# EAGLE design Logic Engine - Rear LED (EAGLE 6.5.0)
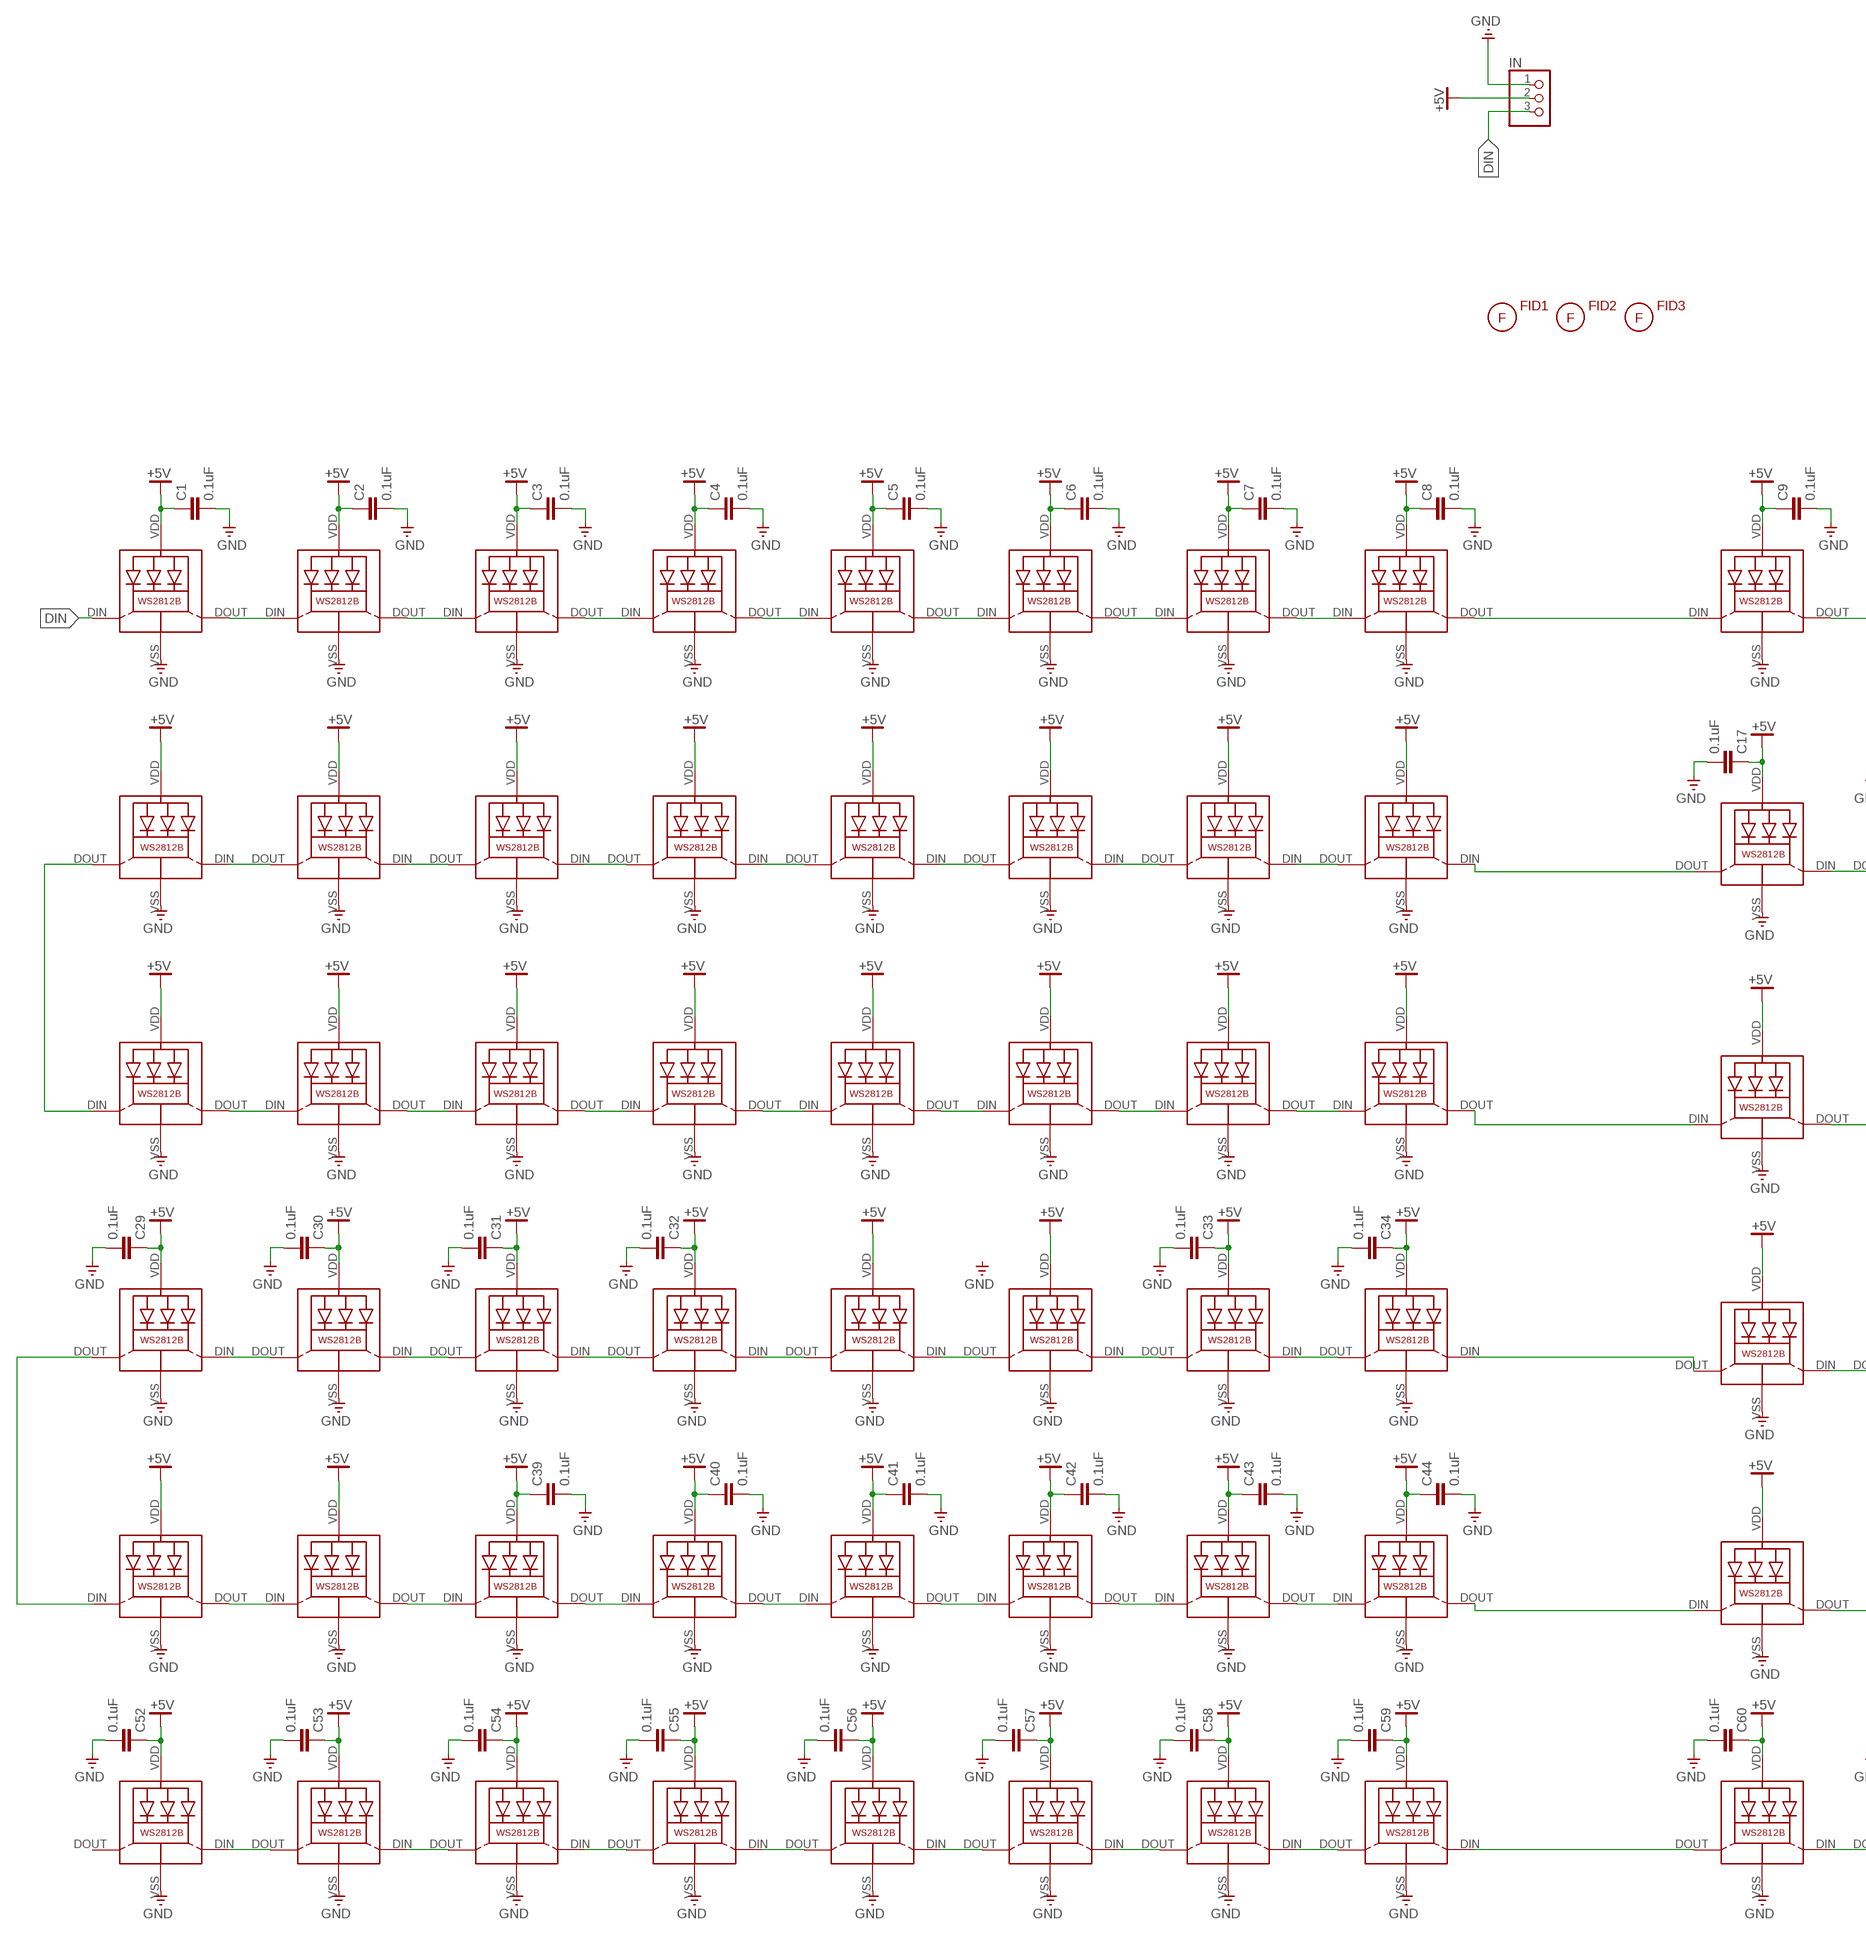
[diagram p0: schematic, sheet 1, part 1 of 2]
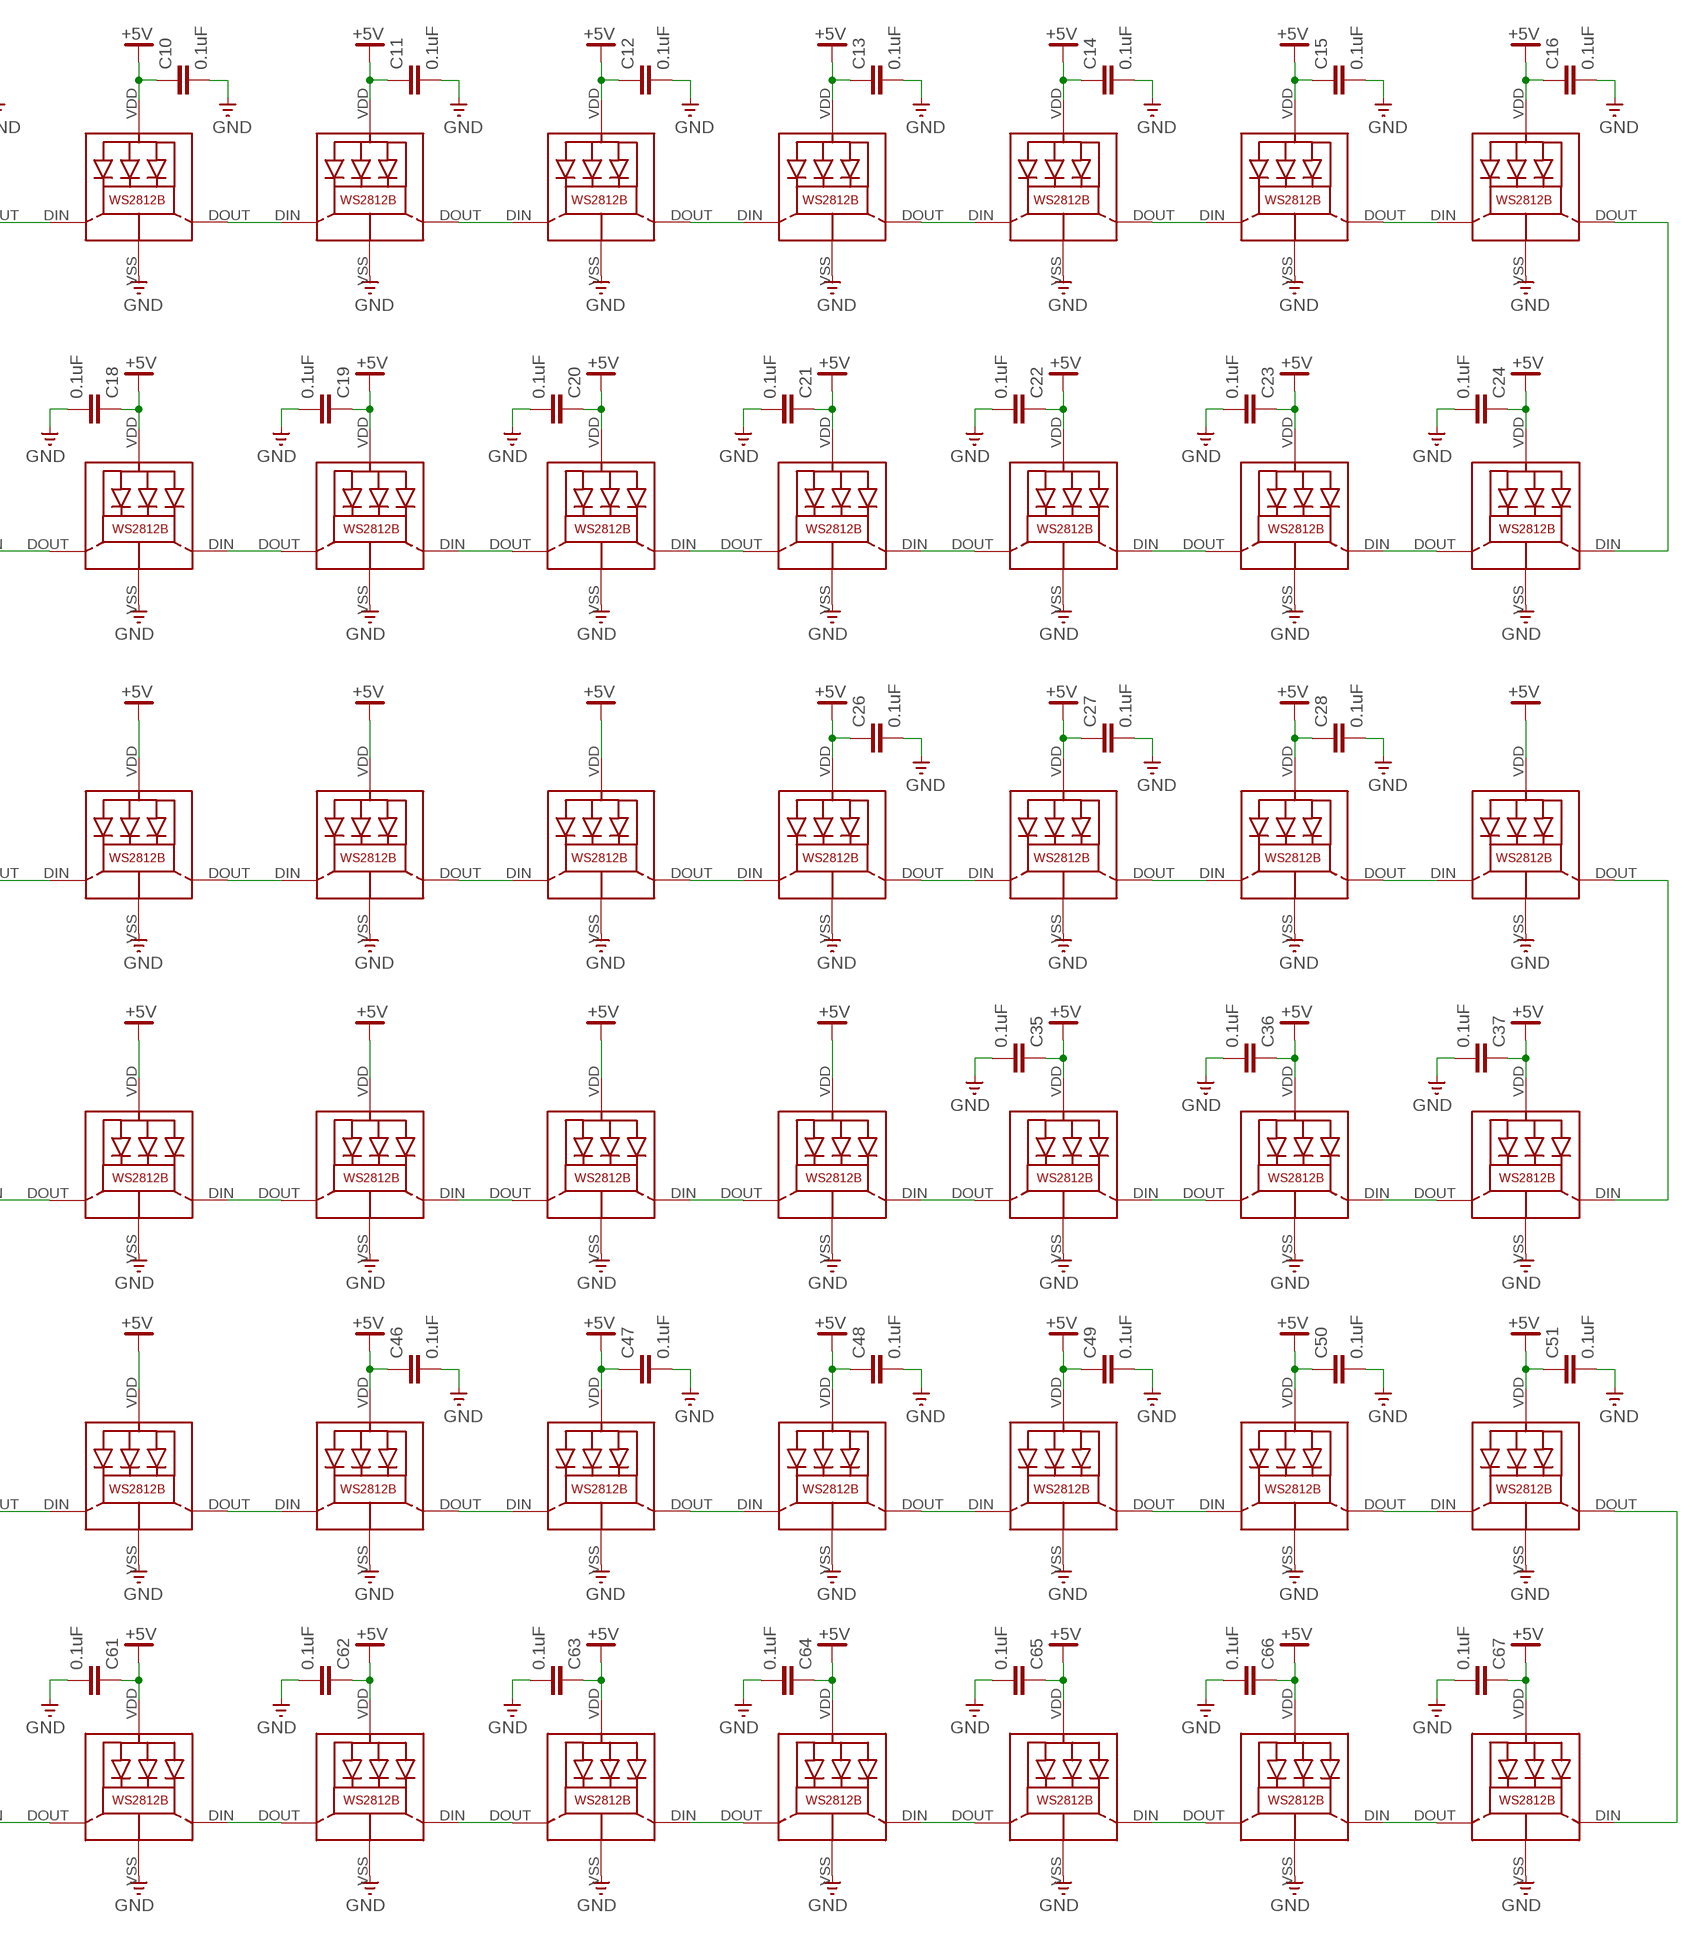
[diagram p1: schematic, sheet 1, part 2 of 2]

## Parts
C1  0.1uF  CAP0603-CAP  [0603-CAP]
C2  0.1uF  CAP0603-CAP  [0603-CAP]
C3  0.1uF  CAP0603-CAP  [0603-CAP]
C4  0.1uF  CAP0603-CAP  [0603-CAP]
C5  0.1uF  CAP0603-CAP  [0603-CAP]
C6  0.1uF  CAP0603-CAP  [0603-CAP]
C7  0.1uF  CAP0603-CAP  [0603-CAP]
C8  0.1uF  CAP0603-CAP  [0603-CAP]
C9  0.1uF  CAP0603-CAP  [0603-CAP]
C10  0.1uF  CAP0603-CAP  [0603-CAP]
C11  0.1uF  CAP0603-CAP  [0603-CAP]
C12  0.1uF  CAP0603-CAP  [0603-CAP]
C13  0.1uF  CAP0603-CAP  [0603-CAP]
C14  0.1uF  CAP0603-CAP  [0603-CAP]
C15  0.1uF  CAP0603-CAP  [0603-CAP]
C16  0.1uF  CAP0603-CAP  [0603-CAP]
C17  0.1uF  CAP0603-CAP  [0603-CAP]
C18  0.1uF  CAP0603-CAP  [0603-CAP]
C19  0.1uF  CAP0603-CAP  [0603-CAP]
C20  0.1uF  CAP0603-CAP  [0603-CAP]
C21  0.1uF  CAP0603-CAP  [0603-CAP]
C22  0.1uF  CAP0603-CAP  [0603-CAP]
C23  0.1uF  CAP0603-CAP  [0603-CAP]
C24  0.1uF  CAP0603-CAP  [0603-CAP]
C26  0.1uF  CAP0603-CAP  [0603-CAP]
C27  0.1uF  CAP0603-CAP  [0603-CAP]
C28  0.1uF  CAP0603-CAP  [0603-CAP]
C29  0.1uF  CAP0603-CAP  [0603-CAP]
C30  0.1uF  CAP0603-CAP  [0603-CAP]
C31  0.1uF  CAP0603-CAP  [0603-CAP]
C32  0.1uF  CAP0603-CAP  [0603-CAP]
C33  0.1uF  CAP0603-CAP  [0603-CAP]
C34  0.1uF  CAP0603-CAP  [0603-CAP]
C35  0.1uF  CAP0603-CAP  [0603-CAP]
C36  0.1uF  CAP0603-CAP  [0603-CAP]
C37  0.1uF  CAP0603-CAP  [0603-CAP]
C39  0.1uF  CAP0603-CAP  [0603-CAP]
C40  0.1uF  CAP0603-CAP  [0603-CAP]
C41  0.1uF  CAP0603-CAP  [0603-CAP]
C42  0.1uF  CAP0603-CAP  [0603-CAP]
C43  0.1uF  CAP0603-CAP  [0603-CAP]
C44  0.1uF  CAP0603-CAP  [0603-CAP]
C46  0.1uF  CAP0603-CAP  [0603-CAP]
C47  0.1uF  CAP0603-CAP  [0603-CAP]
C48  0.1uF  CAP0603-CAP  [0603-CAP]
C49  0.1uF  CAP0603-CAP  [0603-CAP]
C50  0.1uF  CAP0603-CAP  [0603-CAP]
C51  0.1uF  CAP0603-CAP  [0603-CAP]
C52  0.1uF  CAP0603-CAP  [0603-CAP]
C53  0.1uF  CAP0603-CAP  [0603-CAP]
C54  0.1uF  CAP0603-CAP  [0603-CAP]
C55  0.1uF  CAP0603-CAP  [0603-CAP]
C56  0.1uF  CAP0603-CAP  [0603-CAP]
C57  0.1uF  CAP0603-CAP  [0603-CAP]
C58  0.1uF  CAP0603-CAP  [0603-CAP]
C59  0.1uF  CAP0603-CAP  [0603-CAP]
C60  0.1uF  CAP0603-CAP  [0603-CAP]
C61  0.1uF  CAP0603-CAP  [0603-CAP]
C62  0.1uF  CAP0603-CAP  [0603-CAP]
C63  0.1uF  CAP0603-CAP  [0603-CAP]
C64  0.1uF  CAP0603-CAP  [0603-CAP]
C65  0.1uF  CAP0603-CAP  [0603-CAP]
C66  0.1uF  CAP0603-CAP  [0603-CAP]
C67  0.1uF  CAP0603-CAP  [0603-CAP]
FID1  FIDUCIAL  [FIDUCIAL_G15]
FID2  FIDUCIAL  [FIDUCIAL_G15]
FID3  FIDUCIAL  [FIDUCIAL_G15]
IN  PINHD-1X3  [1X03]
L1  WS2812B  [WS2812B]
L2  WS2812B  [WS2812B]
L3  WS2812B  [WS2812B]
L4  WS2812B  [WS2812B]
L5  WS2812B  [WS2812B]
L6  WS2812B  [WS2812B]
L7  WS2812B  [WS2812B]
L8  WS2812B  [WS2812B]
L9  WS2812B  [WS2812B]
L10  WS2812B  [WS2812B]
L11  WS2812B  [WS2812B]
L12  WS2812B  [WS2812B]
L13  WS2812B  [WS2812B]
L14  WS2812B  [WS2812B]
L15  WS2812B  [WS2812B]
L16  WS2812B  [WS2812B]
L17  WS2812B  [WS2812B]
L18  WS2812B  [WS2812B]
L19  WS2812B  [WS2812B]
L20  WS2812B  [WS2812B]
L21  WS2812B  [WS2812B]
L22  WS2812B  [WS2812B]
L23  WS2812B  [WS2812B]
L24  WS2812B  [WS2812B]
L25  WS2812B  [WS2812B]
L26  WS2812B  [WS2812B]
L27  WS2812B  [WS2812B]
L28  WS2812B  [WS2812B]
L29  WS2812B  [WS2812B]
L30  WS2812B  [WS2812B]
L31  WS2812B  [WS2812B]
L32  WS2812B  [WS2812B]
L33  WS2812B  [WS2812B]
L34  WS2812B  [WS2812B]
L35  WS2812B  [WS2812B]
L36  WS2812B  [WS2812B]
L37  WS2812B  [WS2812B]
L38  WS2812B  [WS2812B]
L39  WS2812B  [WS2812B]
L40  WS2812B  [WS2812B]
L41  WS2812B  [WS2812B]
L42  WS2812B  [WS2812B]
L43  WS2812B  [WS2812B]
L44  WS2812B  [WS2812B]
L45  WS2812B  [WS2812B]
L46  WS2812B  [WS2812B]
L47  WS2812B  [WS2812B]
L48  WS2812B  [WS2812B]
L49  WS2812B  [WS2812B]
L50  WS2812B  [WS2812B]
L51  WS2812B  [WS2812B]
L52  WS2812B  [WS2812B]
L53  WS2812B  [WS2812B]
L54  WS2812B  [WS2812B]
L55  WS2812B  [WS2812B]
L56  WS2812B  [WS2812B]
L57  WS2812B  [WS2812B]
L58  WS2812B  [WS2812B]
L59  WS2812B  [WS2812B]
L60  WS2812B  [WS2812B]
L61  WS2812B  [WS2812B]
L62  WS2812B  [WS2812B]
L63  WS2812B  [WS2812B]
L64  WS2812B  [WS2812B]
L65  WS2812B  [WS2812B]
L66  WS2812B  [WS2812B]
L67  WS2812B  [WS2812B]
L68  WS2812B  [WS2812B]
L69  WS2812B  [WS2812B]
L70  WS2812B  [WS2812B]
L71  WS2812B  [WS2812B]
L72  WS2812B  [WS2812B]
L73  WS2812B  [WS2812B]
L74  WS2812B  [WS2812B]
L75  WS2812B  [WS2812B]
L76  WS2812B  [WS2812B]
L77  WS2812B  [WS2812B]
L78  WS2812B  [WS2812B]
L79  WS2812B  [WS2812B]
L80  WS2812B  [WS2812B]
L81  WS2812B  [WS2812B]
L82  WS2812B  [WS2812B]
L83  WS2812B  [WS2812B]
L84  WS2812B  [WS2812B]
L85  WS2812B  [WS2812B]
L86  WS2812B  [WS2812B]
L87  WS2812B  [WS2812B]
L88  WS2812B  [WS2812B]
L89  WS2812B  [WS2812B]
L90  WS2812B  [WS2812B]
L91  WS2812B  [WS2812B]
L92  WS2812B  [WS2812B]
L93  WS2812B  [WS2812B]
L94  WS2812B  [WS2812B]
L95  WS2812B  [WS2812B]
L96  WS2812B  [WS2812B]

## Nets
+5V [supply]: C1.1 C2.1 C3.1 C4.1 C5.1 C6.1 C7.1 C8.1 C9.1 C10.1 C11.1 C12.1 C13.1 C14.1 C15.1 C16.1 C17.1 C18.1 C19.1 C20.1 C21.1 C22.1 C23.1 C24.1 C26.1 C27.1 C28.1 C29.1 C30.1 C31.1 C32.1 C33.1 C34.1 C35.1 C36.1 C37.1 C39.1 C40.1 C41.1 C42.1 C43.1 C44.1 C46.1 C47.1 C48.1 C49.1 C50.1 C51.1 C52.1 C53.1 C54.1 C55.1 C56.1 C57.1 C58.1 C59.1 C60.1 C61.1 C62.1 C63.1 C64.1 C65.1 C66.1 C67.1 IN.2 L1.VDD L2.VDD L3.VDD L4.VDD L5.VDD L6.VDD L7.VDD L8.VDD L9.VDD L10.VDD L11.VDD L12.VDD L13.VDD L14.VDD L15.VDD L16.VDD L17.VDD L18.VDD L19.VDD L20.VDD L21.VDD L22.VDD L23.VDD L24.VDD L25.VDD L26.VDD L27.VDD L28.VDD L29.VDD L30.VDD L31.VDD L32.VDD L33.VDD L34.VDD L35.VDD L36.VDD L37.VDD L38.VDD L39.VDD L40.VDD L41.VDD L42.VDD L43.VDD L44.VDD L45.VDD L46.VDD L47.VDD L48.VDD L49.VDD L50.VDD L51.VDD L52.VDD L53.VDD L54.VDD L55.VDD L56.VDD L57.VDD L58.VDD L59.VDD L60.VDD L61.VDD L62.VDD L63.VDD L64.VDD L65.VDD L66.VDD L67.VDD L68.VDD L69.VDD L70.VDD L71.VDD L72.VDD L73.VDD L74.VDD L75.VDD L76.VDD L77.VDD L78.VDD L79.VDD L80.VDD L81.VDD L82.VDD L83.VDD L84.VDD L85.VDD L86.VDD L87.VDD L88.VDD L89.VDD L90.VDD L91.VDD L92.VDD L93.VDD L94.VDD L95.VDD L96.VDD
DIN: IN.3 L1.DIN(DI)
GND [supply]: C1.2 C2.2 C3.2 C4.2 C5.2 C6.2 C7.2 C8.2 C9.2 C10.2 C11.2 C12.2 C13.2 C14.2 C15.2 C16.2 C17.2 C18.2 C19.2 C20.2 C21.2 C22.2 C23.2 C24.2 C26.2 C27.2 C28.2 C29.2 C30.2 C31.2 C32.2 C33.2 C34.2 C35.2 C36.2 C37.2 C39.2 C40.2 C41.2 C42.2 C43.2 C44.2 C46.2 C47.2 C48.2 C49.2 C50.2 C51.2 C52.2 C53.2 C54.2 C55.2 C56.2 C57.2 C58.2 C59.2 C60.2 C61.2 C62.2 C63.2 C64.2 C65.2 C66.2 C67.2 IN.1 L1.VSS(GND) L2.VSS(GND) L3.VSS(GND) L4.VSS(GND) L5.VSS(GND) L6.VSS(GND) L7.VSS(GND) L8.VSS(GND) L9.VSS(GND) L10.VSS(GND) L11.VSS(GND) L12.VSS(GND) L13.VSS(GND) L14.VSS(GND) L15.VSS(GND) L16.VSS(GND) L17.VSS(GND) L18.VSS(GND) L19.VSS(GND) L20.VSS(GND) L21.VSS(GND) L22.VSS(GND) L23.VSS(GND) L24.VSS(GND) L25.VSS(GND) L26.VSS(GND) L27.VSS(GND) L28.VSS(GND) L29.VSS(GND) L30.VSS(GND) L31.VSS(GND) L32.VSS(GND) L33.VSS(GND) L34.VSS(GND) L35.VSS(GND) L36.VSS(GND) L37.VSS(GND) L38.VSS(GND) L39.VSS(GND) L40.VSS(GND) L41.VSS(GND) L42.VSS(GND) L43.VSS(GND) L44.VSS(GND) L45.VSS(GND) L46.VSS(GND) L47.VSS(GND) L48.VSS(GND) L49.VSS(GND) L50.VSS(GND) L51.VSS(GND) L52.VSS(GND) L53.VSS(GND) L54.VSS(GND) L55.VSS(GND) L56.VSS(GND) L57.VSS(GND) L58.VSS(GND) L59.VSS(GND) L60.VSS(GND) L61.VSS(GND) L62.VSS(GND) L63.VSS(GND) L64.VSS(GND) L65.VSS(GND) L66.VSS(GND) L67.VSS(GND) L68.VSS(GND) L69.VSS(GND) L70.VSS(GND) L71.VSS(GND) L72.VSS(GND) L73.VSS(GND) L74.VSS(GND) L75.VSS(GND) L76.VSS(GND) L77.VSS(GND) L78.VSS(GND) L79.VSS(GND) L80.VSS(GND) L81.VSS(GND) L82.VSS(GND) L83.VSS(GND) L84.VSS(GND) L85.VSS(GND) L86.VSS(GND) L87.VSS(GND) L88.VSS(GND) L89.VSS(GND) L90.VSS(GND) L91.VSS(GND) L92.VSS(GND) L93.VSS(GND) L94.VSS(GND) L95.VSS(GND) L96.VSS(GND)
N$1: L23.DIN(DI) L24.DOUT(DO)
N$2: L22.DIN(DI) L23.DOUT(DO)
N$3: L21.DIN(DI) L22.DOUT(DO)
N$4: L20.DIN(DI) L21.DOUT(DO)
N$5: L19.DIN(DI) L20.DOUT(DO)
N$6: L18.DIN(DI) L19.DOUT(DO)
N$7: L17.DIN(DI) L18.DOUT(DO)
N$8: L33.DOUT(DO) L34.DIN(DI)
N$9: L34.DOUT(DO) L35.DIN(DI)
N$10: L35.DOUT(DO) L36.DIN(DI)
N$11: L36.DOUT(DO) L37.DIN(DI)
N$12: L37.DOUT(DO) L38.DIN(DI)
N$13: L38.DOUT(DO) L39.DIN(DI)
N$14: L39.DOUT(DO) L40.DIN(DI)
N$15: L55.DIN(DI) L56.DOUT(DO)
N$16: L54.DIN(DI) L55.DOUT(DO)
N$17: L53.DIN(DI) L54.DOUT(DO)
N$18: L52.DIN(DI) L53.DOUT(DO)
N$19: L51.DIN(DI) L52.DOUT(DO)
N$20: L50.DIN(DI) L51.DOUT(DO)
N$21: L49.DIN(DI) L50.DOUT(DO)
N$22: L65.DOUT(DO) L66.DIN(DI)
N$23: L66.DOUT(DO) L67.DIN(DI)
N$24: L67.DOUT(DO) L68.DIN(DI)
N$25: L68.DOUT(DO) L69.DIN(DI)
N$26: L69.DOUT(DO) L70.DIN(DI)
N$27: L70.DOUT(DO) L71.DIN(DI)
N$28: L71.DOUT(DO) L72.DIN(DI)
N$29: L24.DIN(DI) L25.DOUT(DO)
N$30: L17.DOUT(DO) L33.DIN(DI)
N$31: L40.DOUT(DO) L41.DIN(DI)
N$32: L48.DOUT(DO) L64.DIN(DI)
N$33: L87.DIN(DI) L88.DOUT(DO)
N$34: L86.DIN(DI) L87.DOUT(DO)
N$35: L85.DIN(DI) L86.DOUT(DO)
N$36: L84.DIN(DI) L85.DOUT(DO)
N$37: L83.DIN(DI) L84.DOUT(DO)
N$38: L82.DIN(DI) L83.DOUT(DO)
N$39: L81.DIN(DI) L82.DOUT(DO)
N$40: L1.DOUT(DO) L2.DIN(DI)
N$41: L2.DOUT(DO) L3.DIN(DI)
N$42: L3.DOUT(DO) L4.DIN(DI)
N$43: L4.DOUT(DO) L5.DIN(DI)
N$44: L5.DOUT(DO) L6.DIN(DI)
N$45: L6.DOUT(DO) L7.DIN(DI)
N$46: L7.DOUT(DO) L8.DIN(DI)
N$47: L56.DIN(DI) L57.DOUT(DO)
N$48: L9.DOUT(DO) L10.DIN(DI)
N$49: L10.DOUT(DO) L11.DIN(DI)
N$50: L11.DOUT(DO) L12.DIN(DI)
N$51: L12.DOUT(DO) L13.DIN(DI)
N$52: L13.DOUT(DO) L14.DIN(DI)
N$53: L14.DOUT(DO) L15.DIN(DI)
N$54: L15.DOUT(DO) L16.DIN(DI)
N$55: L31.DIN(DI) L32.DOUT(DO)
N$56: L30.DIN(DI) L31.DOUT(DO)
N$57: L29.DIN(DI) L30.DOUT(DO)
N$58: L28.DIN(DI) L29.DOUT(DO)
N$59: L27.DIN(DI) L28.DOUT(DO)
N$60: L26.DIN(DI) L27.DOUT(DO)
N$61: L25.DIN(DI) L26.DOUT(DO)
N$62: L41.DOUT(DO) L42.DIN(DI)
N$63: L42.DOUT(DO) L43.DIN(DI)
N$64: L43.DOUT(DO) L44.DIN(DI)
N$65: L44.DOUT(DO) L45.DIN(DI)
N$66: L45.DOUT(DO) L46.DIN(DI)
N$67: L46.DOUT(DO) L47.DIN(DI)
N$68: L47.DOUT(DO) L48.DIN(DI)
N$69: L63.DIN(DI) L64.DOUT(DO)
N$70: L62.DIN(DI) L63.DOUT(DO)
N$71: L61.DIN(DI) L62.DOUT(DO)
N$72: L60.DIN(DI) L61.DOUT(DO)
N$73: L59.DIN(DI) L60.DOUT(DO)
N$74: L58.DIN(DI) L59.DOUT(DO)
N$75: L57.DIN(DI) L58.DOUT(DO)
N$76: L73.DOUT(DO) L74.DIN(DI)
N$77: L74.DOUT(DO) L75.DIN(DI)
N$78: L75.DOUT(DO) L76.DIN(DI)
N$79: L76.DOUT(DO) L77.DIN(DI)
N$80: L77.DOUT(DO) L78.DIN(DI)
N$81: L78.DOUT(DO) L79.DIN(DI)
N$82: L79.DOUT(DO) L80.DIN(DI)
N$83: L95.DIN(DI) L96.DOUT(DO)
N$84: L94.DIN(DI) L95.DOUT(DO)
N$85: L93.DIN(DI) L94.DOUT(DO)
N$86: L92.DIN(DI) L93.DOUT(DO)
N$87: L91.DIN(DI) L92.DOUT(DO)
N$88: L90.DIN(DI) L91.DOUT(DO)
N$89: L89.DIN(DI) L90.DOUT(DO)
N$90: L8.DOUT(DO) L9.DIN(DI)
N$91: L16.DOUT(DO) L32.DIN(DI)
N$92: L49.DOUT(DO) L65.DIN(DI)
N$93: L72.DOUT(DO) L73.DIN(DI)
N$94: L80.DOUT(DO) L96.DIN(DI)
N$95: L88.DIN(DI) L89.DOUT(DO)
Unconnected: L81.DOUT(DO)

## Library data of the parts
C1-C24 C26-C37 C39-C44 C46-C67 = SparkFun-Capacitors:CAP: Capacitor Standard 0603 ceramic capacitor, and 0.1" leaded capacitor.
FID1-FID3 = SmallBatchLibPre1:FIDUCIAL
IN = adafruit:PINHD-1X3: PIN HEADER
L1-L96 = rseries:WS2812B: WS2812B is the 4-pin variant of the WS2812 http://www.mikrocontroller.net/attachment/180459/WS2812B_preliminary.pdf based on WS2812 from https://github.com/adafruit/Adafruit-Eagle-Library

## Net classes
1 supply: width 0.406 mm, drill 0.33 mm, clearance 0.203 mm

## Board
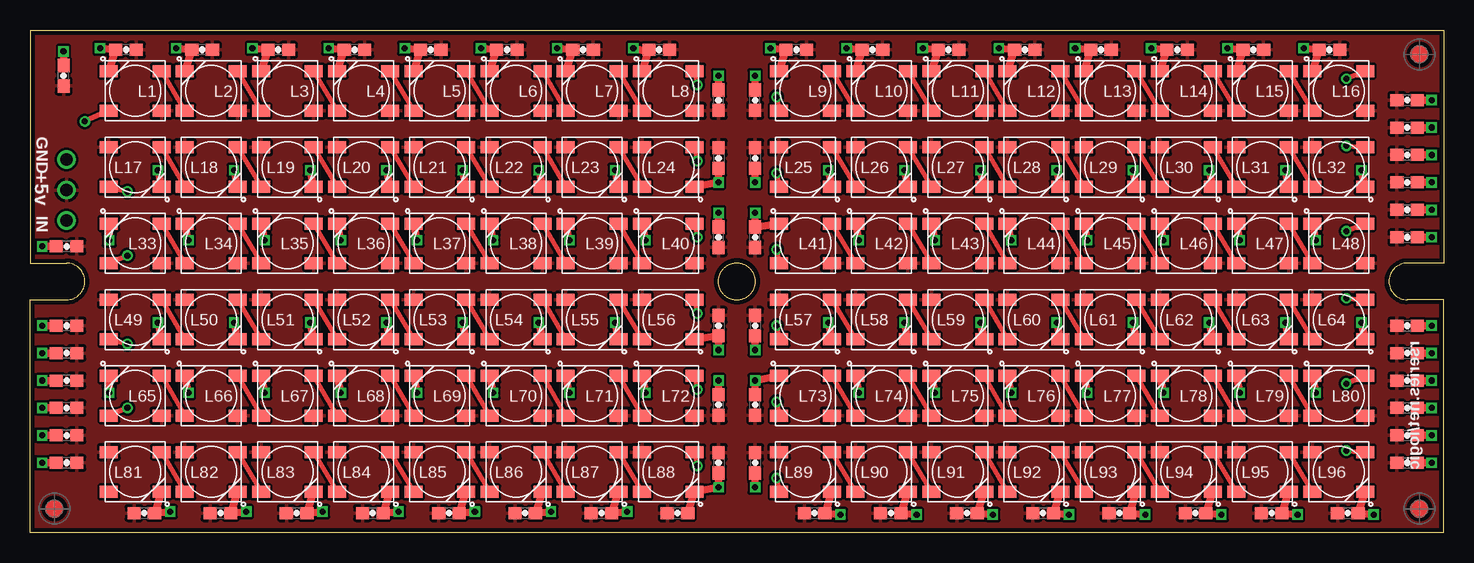
[diagram p2: board, top side]
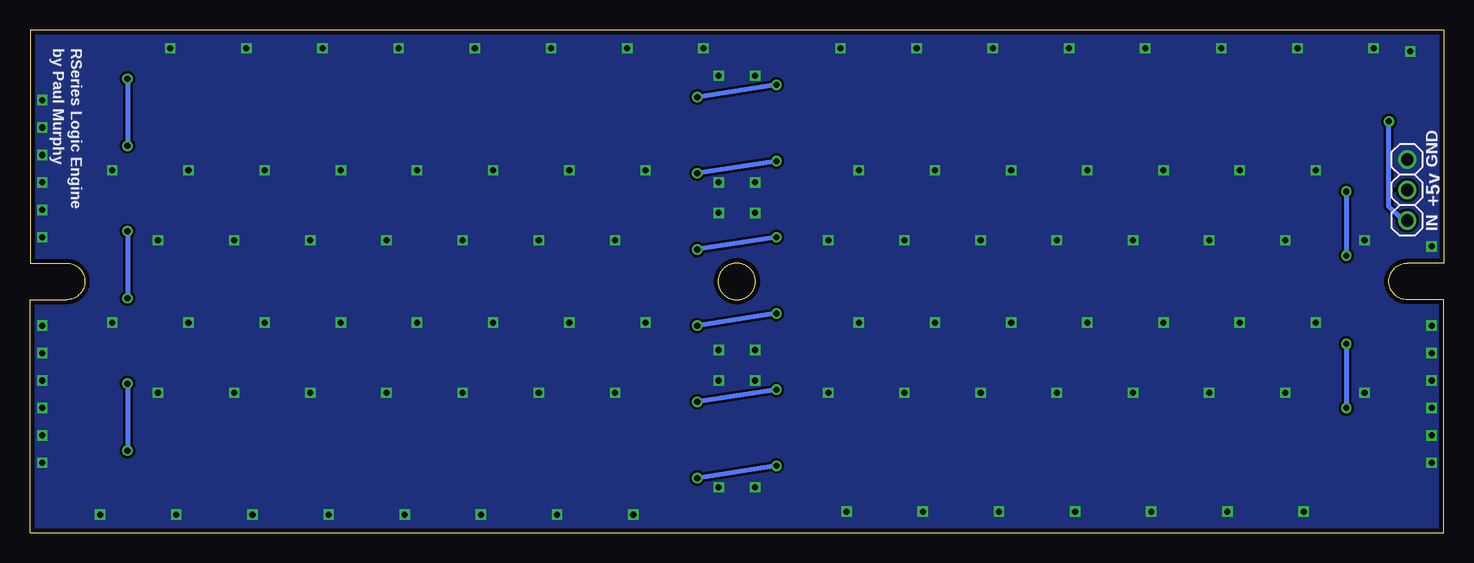
[diagram p3: board, bottom side, seen from below]

Size 117.86 x 41.91 mm. Coordinates in mm from the lower left corner, seen from the top.
Outline: 0,0 0,19.43 3.05,19.43 arc90 4.57,20.95 arc90 3.05,22.48 0,22.48 0,41.91 117.86,41.91 117.86,22.48 114.81,22.48 arc90 113.28,20.95 arc90 114.81,19.43 117.86,19.43 117.86,0 0,0
Outline: circle at 58.93,20.95 radius 1.52
Copper layers (1*16): Top 0.0356mm / dielectric 1.5011mm / Bottom 0.0356mm
Design rules "LaenPCBOrder *": minimum track width 10mil, minimum drill 13mil, track to track 6mil, track to pad 6mil, pad to pad 6mil, via to via 6mil, smd to smd 6mil, copper to edge 15mil, drill to drill 6mil, minimum pad ring 7mil, minimum via ring 7mil, stop-mask expansion 4mil, vias tented up to drill 24mil, thermal gap 10mil

### Footprints (pad centres in the part's own frame; a part is rotated, then mirrored left to right if it is on the bottom)
0603-CAP = smd 1.1 x 1: 1 -0.85,0; 2 0.85,0
1X03 = drill 1.016: 1 -2.54,0; 2 0,0; 3 2.54,0
WS2812B = smd 1.5 x 1: DIN 2.2,1.65; DOUT -2.2,-1.65; VDD -2.2,1.65; VSS 2.2,-1.65

### Placement (x,y rotation side)
C1  8,40.26 180 top
C2  14.35,40.26 180 top
C3  20.7,40.26 180 top
C4  27.05,40.26 180 top
C5  33.4,40.26 180 top
C6  39.75,40.26 180 top
C7  46.1,40.26 180 top
C8  52.45,40.26 180 top
C9  63.88,40.26 180 top
C10  70.23,40.26 180 top
C11  76.58,40.26 180 top
C12  82.93,40.26 180 top
C13  89.28,40.26 180 top
C14  95.63,40.26 180 top
C15  101.98,40.26 180 top
C16  108.33,40.26 180 top
C17  60.45,31.24 270 top
C18  57.4,36.07 90 top
C19  57.4,31.24 270 top
C20  60.45,36.07 90 top
C21  57.4,24.64 90 top
C22  60.45,24.64 90 top
C23  57.4,17.27 270 top
C24  60.45,17.27 270 top
C26  114.81,24.64 0 top
C27  114.81,26.92 0 top
C28  114.81,29.21 0 top
C29  57.4,10.67 90 top
C30  60.45,10.67 90 top
C31  57.4,5.84 270 top
C32  60.45,5.84 270 top
C33  2.79,38.1 90 top
C34  3.05,23.88 180 top
C35  114.81,31.5 0 top
C36  114.81,33.78 0 top
C37  114.81,36.07 0 top
C39  3.05,5.84 180 top
C40  3.05,8.13 180 top
C41  3.05,10.41 180 top
C42  3.05,12.7 180 top
C43  3.05,14.99 180 top
C44  3.05,17.27 180 top
C46  114.81,5.84 0 top
C47  114.81,8.13 0 top
C48  114.81,10.41 0 top
C49  114.81,12.7 0 top
C50  114.81,14.99 0 top
C51  114.81,17.27 0 top
C52  9.53,1.65 0 top
C53  15.88,1.65 0 top
C54  22.23,1.65 0 top
C55  28.57,1.65 0 top
C56  34.92,1.65 0 top
C57  41.27,1.65 0 top
C58  47.62,1.65 0 top
C59  53.98,1.65 0 top
C60  65.41,1.65 0 top
C61  71.75,1.65 0 top
C62  78.11,1.65 0 top
C63  84.45,1.65 0 top
C64  90.81,1.65 0 top
C65  97.16,1.65 0 top
C66  103.5,1.65 0 top
C67  109.86,1.65 0 top
FID1  2.03,2.03 0 top
FID2  115.82,39.88 0 top
FID3  115.82,2.03 0 top
IN  3.05,28.57 270 bottom
L1  8.76,36.83 180 top
L2  15.11,36.83 180 top
L3  21.46,36.83 180 top
L4  27.81,36.83 180 top
L5  34.16,36.83 180 top
L6  40.51,36.83 180 top
L7  46.86,36.83 180 top
L8  53.21,36.83 180 top
L9  64.64,36.83 180 top
L10  70.99,36.83 180 top
L11  77.34,36.83 180 top
L12  83.69,36.83 180 top
L13  90.04,36.83 180 top
L14  96.39,36.83 180 top
L15  102.74,36.83 180 top
L16  109.09,36.83 180 top
L17  8.76,30.48 0 top
L18  15.11,30.48 0 top
L19  21.46,30.48 0 top
L20  27.81,30.48 0 top
L21  34.16,30.48 0 top
L22  40.51,30.48 0 top
L23  46.86,30.48 0 top
L24  53.21,30.48 0 top
L25  64.64,30.48 0 top
L26  70.99,30.48 0 top
L27  77.34,30.48 0 top
L28  83.69,30.48 0 top
L29  90.04,30.48 0 top
L30  96.39,30.48 0 top
L31  102.74,30.48 0 top
L32  109.09,30.48 0 top
L33  8.76,24.13 180 top
L34  15.11,24.13 180 top
L35  21.46,24.13 180 top
L36  27.81,24.13 180 top
L37  34.16,24.13 180 top
L38  40.51,24.13 180 top
L39  46.86,24.13 180 top
L40  53.21,24.13 180 top
L41  64.64,24.13 180 top
L42  70.99,24.13 180 top
L43  77.34,24.13 180 top
L44  83.69,24.13 180 top
L45  90.04,24.13 180 top
L46  96.39,24.13 180 top
L47  102.74,24.13 180 top
L48  109.09,24.13 180 top
L49  8.76,17.78 0 top
L50  15.11,17.78 0 top
L51  21.46,17.78 0 top
L52  27.81,17.78 0 top
L53  34.16,17.78 0 top
L54  40.51,17.78 0 top
L55  46.86,17.78 0 top
L56  53.21,17.78 0 top
L57  64.64,17.78 0 top
L58  70.99,17.78 0 top
L59  77.34,17.78 0 top
L60  83.69,17.78 0 top
L61  90.04,17.78 0 top
L62  96.39,17.78 0 top
L63  102.74,17.78 0 top
L64  109.09,17.78 0 top
L65  8.76,11.43 180 top
L66  15.11,11.43 180 top
L67  21.46,11.43 180 top
L68  27.81,11.43 180 top
L69  34.16,11.43 180 top
L70  40.51,11.43 180 top
L71  46.86,11.43 180 top
L72  53.21,11.43 180 top
L73  64.64,11.43 180 top
L74  70.99,11.43 180 top
L75  77.34,11.43 180 top
L76  83.69,11.43 180 top
L77  90.04,11.43 180 top
L78  96.39,11.43 180 top
L79  102.74,11.43 180 top
L80  109.09,11.43 180 top
L81  8.76,5.08 0 top
L82  15.11,5.08 0 top
L83  21.46,5.08 0 top
L84  27.81,5.08 0 top
L85  34.16,5.08 0 top
L86  40.51,5.08 0 top
L87  46.86,5.08 0 top
L88  53.21,5.08 0 top
L89  64.64,5.08 0 top
L90  70.99,5.08 0 top
L91  77.34,5.08 0 top
L92  83.69,5.08 0 top
L93  90.04,5.08 0 top
L94  96.39,5.08 0 top
L95  102.74,5.08 0 top
L96  109.09,5.08 0 top

### Tracks (layer width: path | path; a pad name or v marks a point on that pad's centre or on a via)
+5V
  pour Top: -3.43,44.58 118.11,44.45 118.11,-3.81 -3.43,-3.68
DIN  (via drill 0.51)
  Top 0.406: L1.DIN v4.57,34.29
  Bottom 0.406: IN.3 3.43,26.04 4.57,27.18 v4.57,34.29
GND  (via drill 0.51)
  Top 0.61: L1.VSS C1.2 v5.84,40.39 | L2.VSS C2.2 v12.19,40.39 | L3.VSS C3.2 v18.54,40.39 | L4.VSS C4.2 v24.89,40.39 | L5.VSS C5.2 v31.24,40.39 | L6.VSS C6.2 v37.59,40.39 | L7.VSS C7.2 v43.94,40.39 | L8.VSS C8.2 51.31,40.13 v50.29,40.39 | v106.17,40.39 C16.2 L16.VSS | v99.82,40.39 C15.2 L15.VSS | L14.VSS C14.2 v93.47,40.39 | L13.VSS C13.2 v87.12,40.39 | L12.VSS C12.2 v80.77,40.39 | L11.VSS C11.2 v74.42,40.39 | L10.VSS C10.2 v68.07,40.39 | L9.VSS C9.2 v61.72,40.39 | C33.2 v2.79,40.13 | C34.2 v1.02,23.88 | C44.2 v1.02,17.27 | C43.2 v1.02,14.99 | C42.2 v1.02,12.7 | C41.2 v1.02,10.41 | C40.2 v1.02,8.13 | C39.2 v1.02,5.84 | C46.2 v116.84,5.84 | C47.2 v116.84,8.13 | C48.2 v116.84,10.41 | C49.2 v116.84,12.7 | C50.2 v116.84,14.99 | C51.2 v116.84,17.27 | C26.2 v116.84,24.64 | C27.2 v116.84,26.92 | C28.2 v116.84,29.21 | C35.2 v116.84,31.5 | C36.2 v116.84,33.78 | C37.2 v116.84,36.07 | C31.2 v57.4,3.81 L88.VSS C59.2 | C32.2 v60.45,3.81 | C29.2 v57.4,12.7 | C30.2 v60.45,12.7 L73.VSS | C24.2 v60.45,15.24 | v57.4,15.24 C23.2 L56.VSS | v57.4,26.67 C21.2 | v60.45,26.67 C22.2 L41.VSS | C17.2 v60.45,29.21 | C19.2 v57.4,29.21 L24.VSS | C20.2 v60.45,38.1 | C18.2 v57.4,38.1 | v49.78,1.78 C58.2 L87.VSS | L86.VSS C57.2 v43.43,1.78 | L85.VSS C56.2 v37.08,1.78 | L84.VSS C55.2 v30.73,1.78 | L83.VSS C54.2 v24.38,1.78 | L82.VSS C53.2 v18.03,1.78 | L81.VSS C52.2 v11.68,1.78 | L96.VSS C67.2 v112.01,1.52 | L95.VSS C66.2 v105.66,1.52 | L94.VSS C65.2 v99.31,1.52 | L93.VSS C64.2 v92.96,1.52 | L92.VSS C63.2 v86.61,1.52 | L91.VSS C62.2 v80.26,1.52 | L90.VSS C61.2 v73.91,1.52 | L89.VSS C60.2 v67.56,1.52 | L40.VSS v51.31,24.38 | L23.VSS v48.77,30.23 | L22.VSS v42.42,30.23 | L21.VSS v36.07,30.23 | L65.VSS v6.6,11.68 | v10.67,17.53 L49.VSS
  Top 0.61: v13.21,11.68 L66.VSS | v19.56,11.68 L67.VSS | v17.02,17.53 L50.VSS | v23.37,17.53 L51.VSS | v25.91,11.68 L68.VSS | v32.26,11.68 L69.VSS | v29.72,17.53 L52.VSS | v36.07,17.53 L53.VSS | v38.61,11.68 L70.VSS | v42.42,17.53 L54.VSS | v44.96,11.68 L71.VSS | v48.77,17.53 L55.VSS | v51.31,11.68 L72.VSS | v44.96,24.38 L39.VSS | v38.61,24.38 L38.VSS | v32.26,24.38 L37.VSS | v25.91,24.38 L36.VSS | v19.56,24.38 L35.VSS | v13.21,24.38 L34.VSS | v6.6,24.38 L33.VSS | v10.67,30.23 L17.VSS | v17.02,30.23 L18.VSS | v23.37,30.23 L19.VSS | v29.72,30.23 L20.VSS | L25.VSS v66.55,30.23 | L26.VSS v72.9,30.23 | L27.VSS v79.25,30.23 | L28.VSS v85.6,30.23 | L29.VSS v91.95,30.23 | L30.VSS v98.3,30.23 | L31.VSS v104.65,30.23 | L32.VSS v111,30.23 | L48.VSS v107.19,24.38 | L47.VSS v100.84,24.38 | L46.VSS v94.49,24.38 | L45.VSS v88.14,24.38 | L44.VSS v81.79,24.38 | L43.VSS v75.44,24.38 | L42.VSS v69.09,24.38 | L57.VSS v66.55,17.53 | L58.VSS v72.9,17.53 | L59.VSS v79.25,17.53 | L60.VSS v85.6,17.53 | L61.VSS v91.95,17.53 | L62.VSS v98.3,17.53 | L63.VSS v104.65,17.53 | L64.VSS v111,17.53 | L80.VSS v107.19,11.68 | L79.VSS v100.84,11.68 | L78.VSS v94.49,11.68 | L77.VSS v88.14,11.68 | L76.VSS v81.79,11.68 | L75.VSS v75.44,11.68 | L74.VSS v69.09,11.68
  pour Bottom (no thermals): -5.21,44.96 119.38,44.96 119.38,-5.08 -5.21,-5.08
N$1
  Top 0.406: L23.DIN L24.DOUT
N$2
  Top 0.406: L22.DIN L23.DOUT
N$3
  Top 0.406: L21.DIN L22.DOUT
N$4
  Top 0.406: L20.DIN L21.DOUT
N$5
  Top 0.406: L19.DIN L20.DOUT
N$6
  Top 0.406: L18.DIN L19.DOUT
N$7
  Top 0.406: L17.DIN L18.DOUT
N$8
  Top 0.406: L33.DOUT L34.DIN
N$9
  Top 0.406: L34.DOUT L35.DIN
N$10
  Top 0.406: L35.DOUT L36.DIN
N$11
  Top 0.406: L36.DOUT L37.DIN
N$12
  Top 0.406: L37.DOUT L38.DIN
N$13
  Top 0.406: L38.DOUT L39.DIN
N$14
  Top 0.406: L39.DOUT L40.DIN
N$15
  Top 0.406: L55.DIN L56.DOUT
N$16
  Top 0.406: L54.DIN L55.DOUT
N$17
  Top 0.406: L53.DIN L54.DOUT
N$18
  Top 0.406: L52.DIN L53.DOUT
N$19
  Top 0.406: L51.DIN L52.DOUT
N$20
  Top 0.406: L50.DIN L51.DOUT
N$21
  Top 0.406: L49.DIN L50.DOUT
N$22
  Top 0.406: L65.DOUT L66.DIN
N$23
  Top 0.406: L66.DOUT L67.DIN
N$24
  Top 0.406: L68.DIN L67.DOUT
N$25
  Top 0.406: L68.DOUT L69.DIN
N$26
  Top 0.406: L69.DOUT L70.DIN
N$27
  Top 0.406: L70.DOUT L71.DIN
N$28
  Top 0.406: L71.DOUT L72.DIN
N$29  (via drill 0.51)
  Top 0.406: L24.DIN v55.63,30.99 | v62.23,29.97 L25.DOUT
  Bottom 0.406: v55.63,30.99 v62.23,29.97
N$30  (via drill 0.51)
  Top 0.406: L17.DOUT v8.13,28.45 | v8.13,23.11 L33.DIN
  Bottom 0.406: v8.13,28.45 v8.13,23.11
N$31  (via drill 0.51)
  Top 0.406: L40.DOUT v55.63,24.64 | v62.23,23.62 L41.DIN
  Bottom 0.406: v55.63,24.64 v62.23,23.62
N$32  (via drill 0.51)
  Top 0.406: L48.DOUT v109.73,25.15 | v109.73,19.56 L64.DIN
  Bottom 0.406: v109.73,25.15 v109.73,19.56
N$33
  Top 0.406: L87.DIN L88.DOUT
N$34
  Top 0.406: L86.DIN L87.DOUT
N$35
  Top 0.406: L85.DIN L86.DOUT
N$36
  Top 0.406: L84.DIN L85.DOUT
N$37
  Top 0.406: L83.DIN L84.DOUT
N$38
  Top 0.406: L82.DIN L83.DOUT
N$39
  Top 0.406: L81.DIN L82.DOUT
N$40
  Top 0.406: L1.DOUT L2.DIN
N$41
  Top 0.406: L2.DOUT L3.DIN
N$42
  Top 0.406: L3.DOUT L4.DIN
N$43
  Top 0.406: L4.DOUT L5.DIN
N$44
  Top 0.406: L5.DOUT L6.DIN
N$45
  Top 0.406: L6.DOUT L7.DIN
N$46
  Top 0.406: L7.DOUT L8.DIN
N$47  (via drill 0.51)
  Top 0.406: L56.DIN v55.63,18.29 | v62.23,17.27 L57.DOUT
  Bottom 0.406: v55.63,18.29 v62.23,17.27
N$48
  Top 0.406: L9.DOUT L10.DIN
N$49
  Top 0.406: L10.DOUT L11.DIN
N$50
  Top 0.406: L11.DOUT L12.DIN
N$51
  Top 0.406: L12.DOUT L13.DIN
N$52
  Top 0.406: L14.DIN L13.DOUT
N$53
  Top 0.406: L15.DIN L14.DOUT
N$54
  Top 0.406: L16.DIN L15.DOUT
N$55
  Top 0.406: L32.DOUT L31.DIN
N$56
  Top 0.406: L31.DOUT L30.DIN
N$57
  Top 0.406: L30.DOUT L29.DIN
N$58
  Top 0.406: L28.DIN L29.DOUT
N$59
  Top 0.406: L27.DIN L28.DOUT
N$60
  Top 0.406: L26.DIN L27.DOUT
N$61
  Top 0.406: L25.DIN L26.DOUT
N$62
  Top 0.406: L41.DOUT L42.DIN
N$63
  Top 0.406: L42.DOUT L43.DIN
N$64
  Top 0.406: L43.DOUT L44.DIN
N$65
  Top 0.406: L44.DOUT L45.DIN
N$66
  Top 0.406: L46.DIN L45.DOUT
N$67
  Top 0.406: L47.DIN L46.DOUT
N$68
  Top 0.406: L48.DIN L47.DOUT
N$69
  Top 0.406: L64.DOUT L63.DIN
N$70
  Top 0.406: L63.DOUT L62.DIN
N$71
  Top 0.406: L62.DOUT L61.DIN
N$72
  Top 0.406: L60.DIN L61.DOUT
N$73
  Top 0.406: L59.DIN L60.DOUT
N$74
  Top 0.406: L58.DIN L59.DOUT
N$75
  Top 0.406: L57.DIN L58.DOUT
N$76
  Top 0.406: L74.DIN L73.DOUT
N$77
  Top 0.406: L75.DIN L74.DOUT
N$78
  Top 0.406: L76.DIN L75.DOUT
N$79
  Top 0.406: L77.DIN L76.DOUT
N$80
  Top 0.406: L78.DIN L77.DOUT
N$81
  Top 0.406: L79.DIN L78.DOUT
N$82
  Top 0.406: L80.DIN L79.DOUT
N$83
  Top 0.406: L96.DOUT L95.DIN
N$84
  Top 0.406: L95.DOUT L94.DIN
N$85
  Top 0.406: L94.DOUT L93.DIN
N$86
  Top 0.406: L93.DOUT L92.DIN
N$87
  Top 0.406: L92.DOUT L91.DIN
N$88
  Top 0.406: L91.DOUT L90.DIN
N$89
  Top 0.406: L90.DOUT L89.DIN
N$90  (via drill 0.51)
  Top 0.406: L8.DOUT v55.63,37.34 | v62.23,36.32 L9.DIN
  Bottom 0.406: v55.63,37.34 v62.23,36.32
N$91  (via drill 0.51)
  Top 0.406: L16.DOUT v109.73,37.85 | v109.73,32.26 L32.DIN
  Bottom 0.406: v109.73,37.85 v109.73,32.26
N$92  (via drill 0.51)
  Top 0.406: L49.DOUT v8.13,15.75 | v8.13,10.41 L65.DIN
  Bottom 0.406: v8.13,15.75 v8.13,10.41
N$93  (via drill 0.51)
  Top 0.406: L72.DOUT v55.63,11.94 | v62.23,10.92 L73.DIN
  Bottom 0.406: v55.63,11.94 v62.23,10.92
N$94  (via drill 0.51)
  Top 0.406: L80.DOUT v109.73,12.45 | v109.73,6.86 L96.DIN
  Bottom 0.406: v109.73,12.45 v109.73,6.86
N$95  (via drill 0.51)
  Top 0.406: L88.DIN v55.63,5.59 | v62.23,4.57 L89.DOUT
  Bottom 0.406: v55.63,5.59 v62.23,4.57

### Text on the board
tPlace: rseries.net/logic
bPlace: RSeries Logic Engine / by Paul Murphy | GND
tNames: GND | +5v | IN
bNames: +5v